# Altium schematic sheet KeeWatch_SAMD21.SchDoc
size Letter
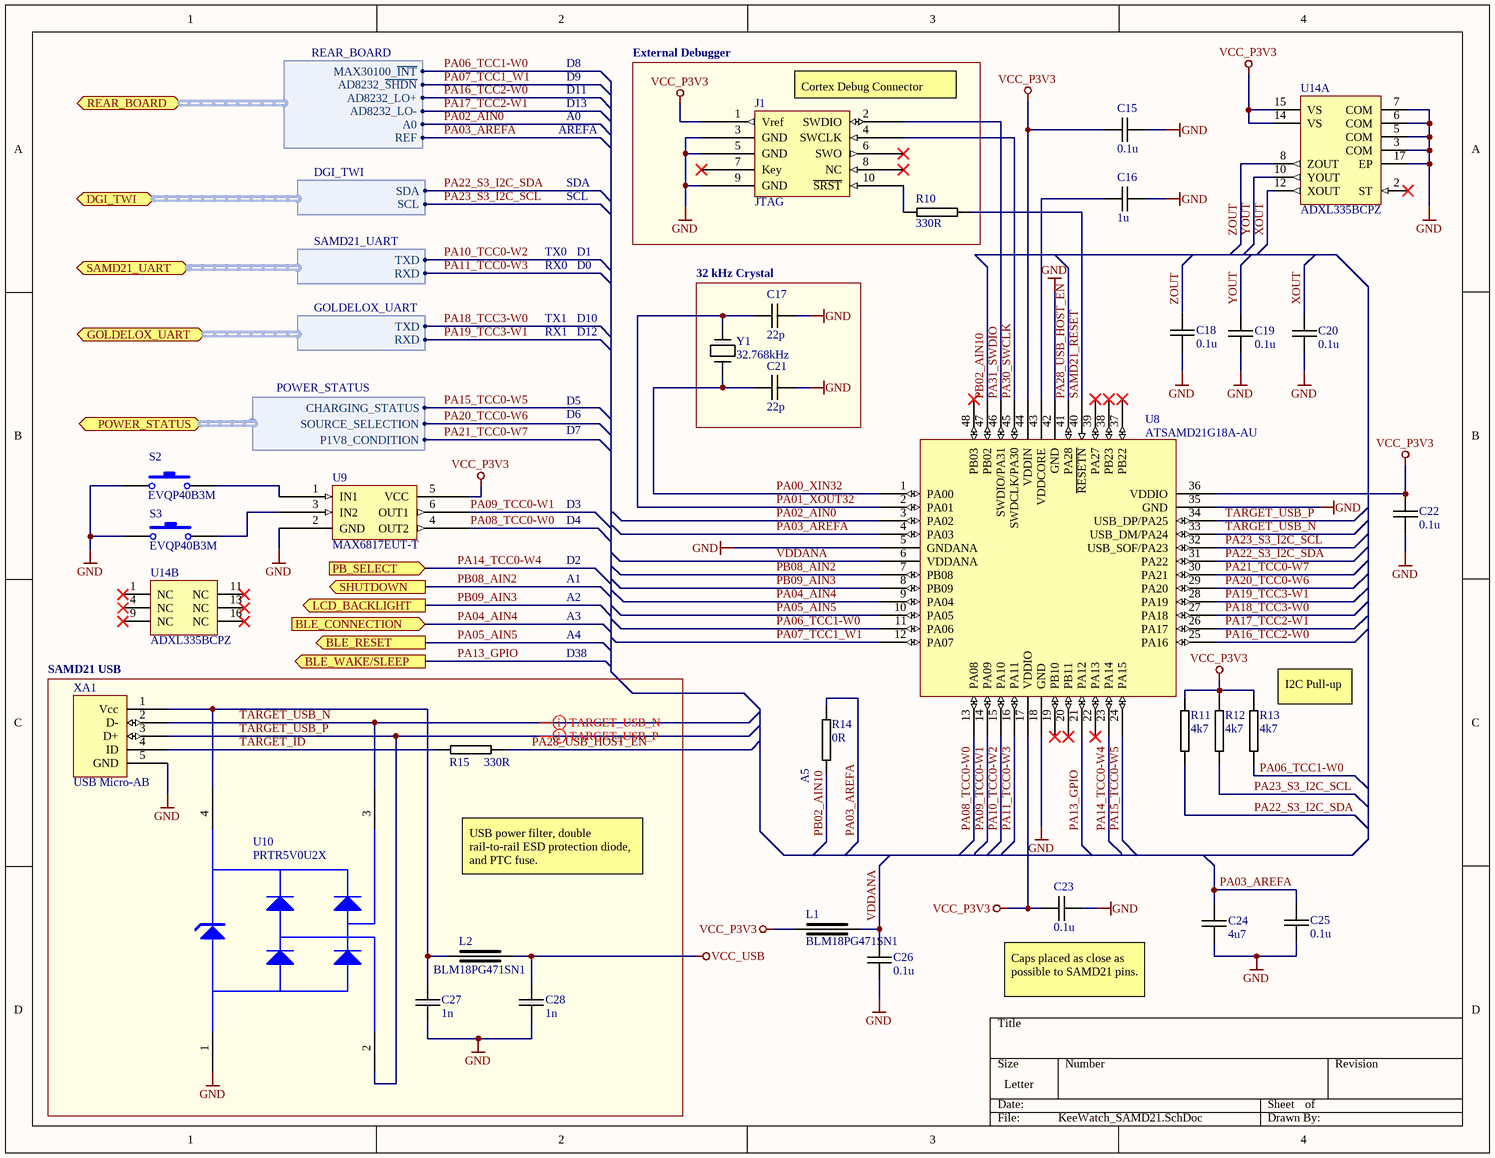
[diagram p0: KeeWatch_SAMD21.SchDoc]

## Parts
C15  0.1u  [0603-Cap]
C16  1u  [0603-Cap]
C17  22p  [0603-Cap]
C18  0.1u  [0603-Cap]
C19  0.1u  [0603-Cap]
C20  0.1u  [0603-Cap]
C21  22p  [0603-Cap]
C22  0.1u  [0603-Cap]
C23  0.1u  [0603-Cap]
C24  4u7  [0603-Cap]
C25  0.1u  [0603-Cap]
C26  0.1u  [0603-Cap]
C27  1n  [0603-Cap]
C28  1n  [0603-Cap]
J1  JTAG  [SWD CONNECTOR]
L1  BLM18PG471SN1  [0603-IND]
L2  BLM18PG471SN1  [0603-IND]
R10  330R  [0603-RES]
R11  4k7  [0603-RES]
R12  4k7  [0603-RES]
R13  4k7  [0603-RES]
R14  0R  [0603-RES]
R15  330R  [0603-RES]
S2  EVQP40B3M  [EVQP4]
S3  EVQP40B3M  [EVQP4]
U8  ATSAMD21G18A-AU  [48AA_N]
U9  MAX6817EUT-T  [Z6+1_N]
U10  PRTR5V0U2X  [SOT143B]
U14  ADXL335BCPZ  [ADI-CP-16-14_N]  (parts A,B of 2)
XA1  USB Micro-AB  [MICRO USB B]
Y1  32.768kHz  [32.768KHZ CRYSTAL]

## Blocks framed on the sheet
External Debugger: J1 R10
32 kHz Crystal: C17 C21 Y1

## Ports
BLE_CONNECTION (in), BLE_RESET (out), BLE_WAKE/SLEEP (out), DGI_TWI (harness DGI_TWI), GOLDELOX_UART (harness GOLDELOX_UART), LCD_BACKLIGHT (out), PB_SELECT (in), POWER_STATUS (harness POWER_STATUS), REAR_BOARD (harness REAR_BOARD), SAMD21_UART (harness SAMD21_UART), SHUTDOWN (out)

## Harnesses
SAMD21_UART: TXD, RXD
DGI_TWI: SDA, SCL
GOLDELOX_UART: TXD, RXD
POWER_STATUS: CHARGING_STATUS, SOURCE_SELECTION, P1V8_CONDITION
REAR_BOARD: MAX30100_~{INT}, AD8232_~{SHDN}, AD8232_LO+, AD8232_LO-, A0, REF

## Nets
GND: C15.2 C16.2 C17.2 C18.1 C19.2 C20.2 C21.2 C22.2 C23.2 C24.1 C25.1 C26.2 C27.2 C28.2 J1.3(GND) J1.5(GND) J1.9(GND) S2.1 S3.1 U8.5(GNDANA) U8.18(GND) U8.35(GND) U8.42(GND) U9.2(GND) U10.1 U14.3(COM) U14.5(COM) U14.6(COM) U14.7(COM) U14.17(EP) XA1.5(GND)
VCC_P3V3: C15.1 C22.1 C23.1 J1.1(Vref) L1.2 R11.1 R12.1 R13.1 U8.17(VDDIO) U8.36(VDDIO) U8.44(VDDIN) U9.5(VCC) U14.14(VS) U14.15(VS)
VCC_USB: C28.1 L2.1
PA00_XIN32: C21.1 U8.1(PA00) Y1.1
PA01_XOUT32: C17.1 U8.2(PA01) Y1.2
PA02_AIN0: U8.3(PA02) ; port REAR_BOARD.A0
PA03_AREFA: C24.2 C25.2 R14.1 U8.4(PA03) ; port REAR_BOARD.REF
PA04_AIN4: U8.9(PA04) ; port BLE_CONNECTION
PA05_AIN5: U8.10(PA05) ; port BLE_RESET
PA06_TCC1-W0: R13.2 U8.11(PA06) ; port REAR_BOARD.MAX30100_~{INT}
PA07_TCC1_W1: U8.12(PA07) ; port REAR_BOARD.AD8232_~{SHDN}
PA08_TCC0-W0: U8.13(PA08) U9.4(OUT2)
PA09_TCC0-W1: U8.14(PA09) U9.6(OUT1)
PA10_TCC0-W2: U8.15(PA10) ; port SAMD21_UART.TXD
PA11_TCC0-W3: U8.16(PA11) ; port SAMD21_UART.RXD
PA13_GPIO: U8.21(PA12) ; port BLE_WAKE/SLEEP
PA14_TCC0-W4: U8.23(PA14) ; port PB_SELECT
PA15_TCC0-W5: U8.24(PA15) ; harness POWER_STATUS.CHARGING_STATUS
PA16_TCC2-W0: U8.25(PA16) ; port REAR_BOARD.AD8232_LO+
PA17_TCC2-W1: U8.26(PA17) ; port REAR_BOARD.AD8232_LO-
PA18_TCC3-W0: U8.27(PA18) ; port GOLDELOX_UART.TXD
PA19_TCC3-W1: U8.28(PA19) ; port GOLDELOX_UART.RXD
PA20_TCC0-W6: U8.29(PA20) ; harness POWER_STATUS.SOURCE_SELECTION
PA21_TCC0-W7: U8.30(PA21) ; harness POWER_STATUS.P1V8_CONDITION
PA22_S3_I2C_SDA: R11.2 U8.31(PA22) ; port DGI_TWI.SDA
PA23_S3_I2C_SCL: R12.2 U8.32(USB_SOF/PA23) ; port DGI_TWI.SCL
PA28_USB_HOST_EN: R15.2 U8.41(PA28)
PA30_SWCLK: J1.4(SWCLK) U8.45(SWDCLK/PA30)
PA31_SWDIO: J1.2(SWDIO) U8.46(SWDIO/PA31)
PB02_AIN10: R14.2 U8.47(PB02)
PB08_AIN2: U8.7(PB08) ; port SHUTDOWN
PB09_AIN3: U8.8(PB09) ; port LCD_BACKLIGHT
SAMD21_RESET: R10.2 U8.40(~{RESETN})
TARGET_ID: R15.1 XA1.4(ID)
TARGET_USB_N: U8.33(USB_DM/PA24) U10.3 XA1.2(D-)
TARGET_USB_P: U8.34(USB_DP/PA25) U10.2 XA1.3(D+)
VDDANA: C26.1 L1.1 U8.6(VDDANA)
XOUT: C20.1 U14.12(XOUT)
YOUT: C19.1 U14.10(YOUT)
ZOUT: C18.2 U14.8(ZOUT)
NetC16_1: C16.1 U8.43(VDDCORE)
NetC27_1: C27.1 L2.2 U10.4 XA1.1(Vcc)
NetJ1_10: J1.10(~{SRST}) R10.1
NetS2_2: S2.2 U9.1(IN1)
NetS3_2: S3.2 U9.3(IN2)

Not connected (* = marked no-connect by the designer): J1 6(SWO)* 7(Key)* 8(NC)*; U8 19(PB10)* 20(PB11)* 22(PA13)* 37(PB22)* 38(PB23)* 39(PA27)* 48(PB03)*; U14 1(NC)* 2(ST)* 4(NC)* 9(NC)* 11(NC)* 13(NC)* 16(NC)*

## Layout directives
differential pair: TARGET_USB_N, TARGET_USB_P

## Notes on the sheet
- D11
- D9
- D8
- (near J1) Cortex Debug Connector
- AREFA
- A0
- D13
- SCL
- SDA
- RX0
- TX0
- D1
- D0
- TX1
- RX1
- D10
- D12
- D5
- D6
- D7
- D3
- D4
- D2
- A1
- A2
- A3
- A4
- SAMD21 USB
- D38
- (near R13) I2C Pull-up
- (near R14) A5
- USB power filter, double rail-to-rail ESD protection diode, and PTC fuse.
- (near C23) Caps placed as close as possible to SAMD21 pins.

## Library data of the parts
C15-C28 = 0603-Cap: CAPACITOR 0603 CERAMIC
J1 = JTAG: JTAG CONNECTOR
L1 L2 = 0603FB-1KZ: FERRITE BEAD 1000 OHM 400mA; Manufacturer: TDK Corporation; Manufacturer Part Number: MMZ1608R102A; Reel: F1; Supplier 1: Digi-Key; Supplier Part Number 1: 445-1548-2-ND
R10-R15 = 0603-Res: GENERIC RESISTOR 0603
U9 = MAX6817EUT-T: ±15kV ESD-Protected,Dual, CMOS Switch Debouncer
U14 = ADXL335BCPZ: Small, Low Power, 3-Axis +/-3 g Accelerometer with Analog Output, 1.6 KHz BW, Industrial, 16-pin QFN, Tray; Manufacturer: Analog Devices; # of Axes: 3; -3dB Bandwidth: 1.6 KHz; Sensitivity: 300 mV/g; Supply Current: 350 uA; Voltage Supply (V): 1.8 to 3.6; DatasheetVersion: Rev. B; PackageVersion: 051909-A, 05/2009; PackageReference: CP-16-14; PackageDescription: 16-Pin Lead Frame Chip Scale Package, 4 x 4 mm Body, 0.65 mm Pitch; Supplier 1: Digi-Key; Supplier Part Number 1: ADXL335BCPZ-ND; Supplier 2: Farnell; Supplier Part Number 2: 2068032; Supplier 3: Newark; Supplier Part Number 3: 45P6448; Supplier 4: Mouser; Supplier Part Number 4: 584-ADXL335BCPZ; Output Type: Analog; Packing: Tray; Mounting Technology: Surface Mount; Code_JEDEC: MO-220-WGGD; PartNumber: ADXL335BCPZ; ComponentLink1Description: Manufacturer URL; ComponentLink1URL: http://www.analog.com/en/index.html; ComponentLink2Description: Datasheet; ComponentLink2URL: http://www.analog.com/static/imported-files/data_sheets/ADXL335.pdf; ComponentLink3Description: Package Specification; ComponentLink3URL: http:/www.analog.com/static/imported-files/packages/PKG_PDF/LFCSP(CP)/CP-16/CP_16_14.pdf; ComponentLink4Description: Product URL; ComponentLink4URL: http://www.analog.com/en/mems-sensors/mems-inertial-sensors/adxl335/products/product.html
XA1 = MICRO USB B: USB Connectors MICRO USB B RECEPT TOP MOUNT
Y1 = ABS05-32.768KHZ-9-T: 32.768kHz SMD LOW PROFILE CRYSTAL